# EAGLE schematic equail (EAGLE 6.5.0)
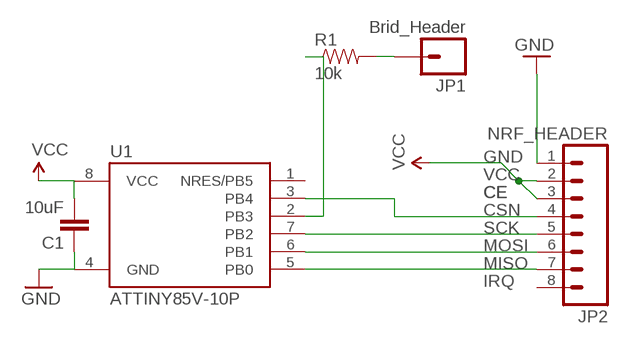
[diagram p0: schematic, sheet 1]

## Parts
C1  10uF  CAPEZ  [CAP-PTH-SMALLEZ]
JP1  Brid_Header  M01PTH  [1X01]
JP2  NRF_HEADER  M08  [1X08_PIN1_NO_SILK]
R1  10k  RESISTORPTH-1/6W  [1/6W-RES]
U1  ATTINY85V-10P  [PDIP08_300MIL]

## Nets
GND: C1.1 JP2.1 U1.4(GND)
N$1: JP1.1 R1.2
N$2: R1.1 U1.2(PB3)
N$3: JP2.4 U1.3(PB4)
N$4: JP2.7 U1.5(PB0)
N$5: JP2.6 U1.6(PB1)
N$6: JP2.5 U1.7(PB2)
VCC: C1.2 JP2.2 JP2.3 U1.8(VCC)
Unconnected: JP2.8 U1.1(NRES/PB5)

## Notes on the sheet
- GND
- VCC
- CE | CE
- CSN
- SCK
- MOSI
- MISO
- IRQ

## Library data of the parts
C1 = SparkFun-Capacitors:CAP: Capacitor Standard 0603 ceramic capacitor, and 0.1" leaded capacitor.
JP1 = SparkFun-Connectors:M01: Header 1 Standard 1-pin 0.1" header. Use with straight break away headers (SKU : PRT-00116), right angle break away headers (PRT-00553), swiss pins (PRT-00743), machine pins (PRT-00117), and female headers (PRT-00115).
JP2 = SparkFun-Connectors:M08: Header 8 Standard 8-pin 0.1" header. Use with straight break away headers (SKU : PRT-00116), right angle break away headers (PRT-00553), swiss pins (PRT-00743), machine pins (PRT-00117), and female headers (PRT-00115).
R1 = SparkFun-Passives:RESISTOR: Resistor Basic schematic elements and footprints for 0603, 1206, and PTH resistors.
U1 = _hhn_attiny25_45_85:ATTINY85*: ATMEL ATtiny 85 Packages: P = PDIP 08 30mil S = SOIC 08 EIAJ 208mil Technologies Note: for complete ordering code (temp. range, finish, tape&reel etc.) see www.atmel.com • Supply Voltage: V = (1.8…5.5)V | [blank] = (2.7…5.5)V • Speed: 10 = 10 MHz | 20 = 20 MHz Author: Dipl.-Ing. FH Rainer Bayer HHN Hochschule Heilbronn (Heilbronn University), rainer.bayer@hs-heilbronn.de Ingenieurbüro ing-rb, mail@ing-rb.de